# EAGLE design BeamerCtrl (EAGLE 6.4)
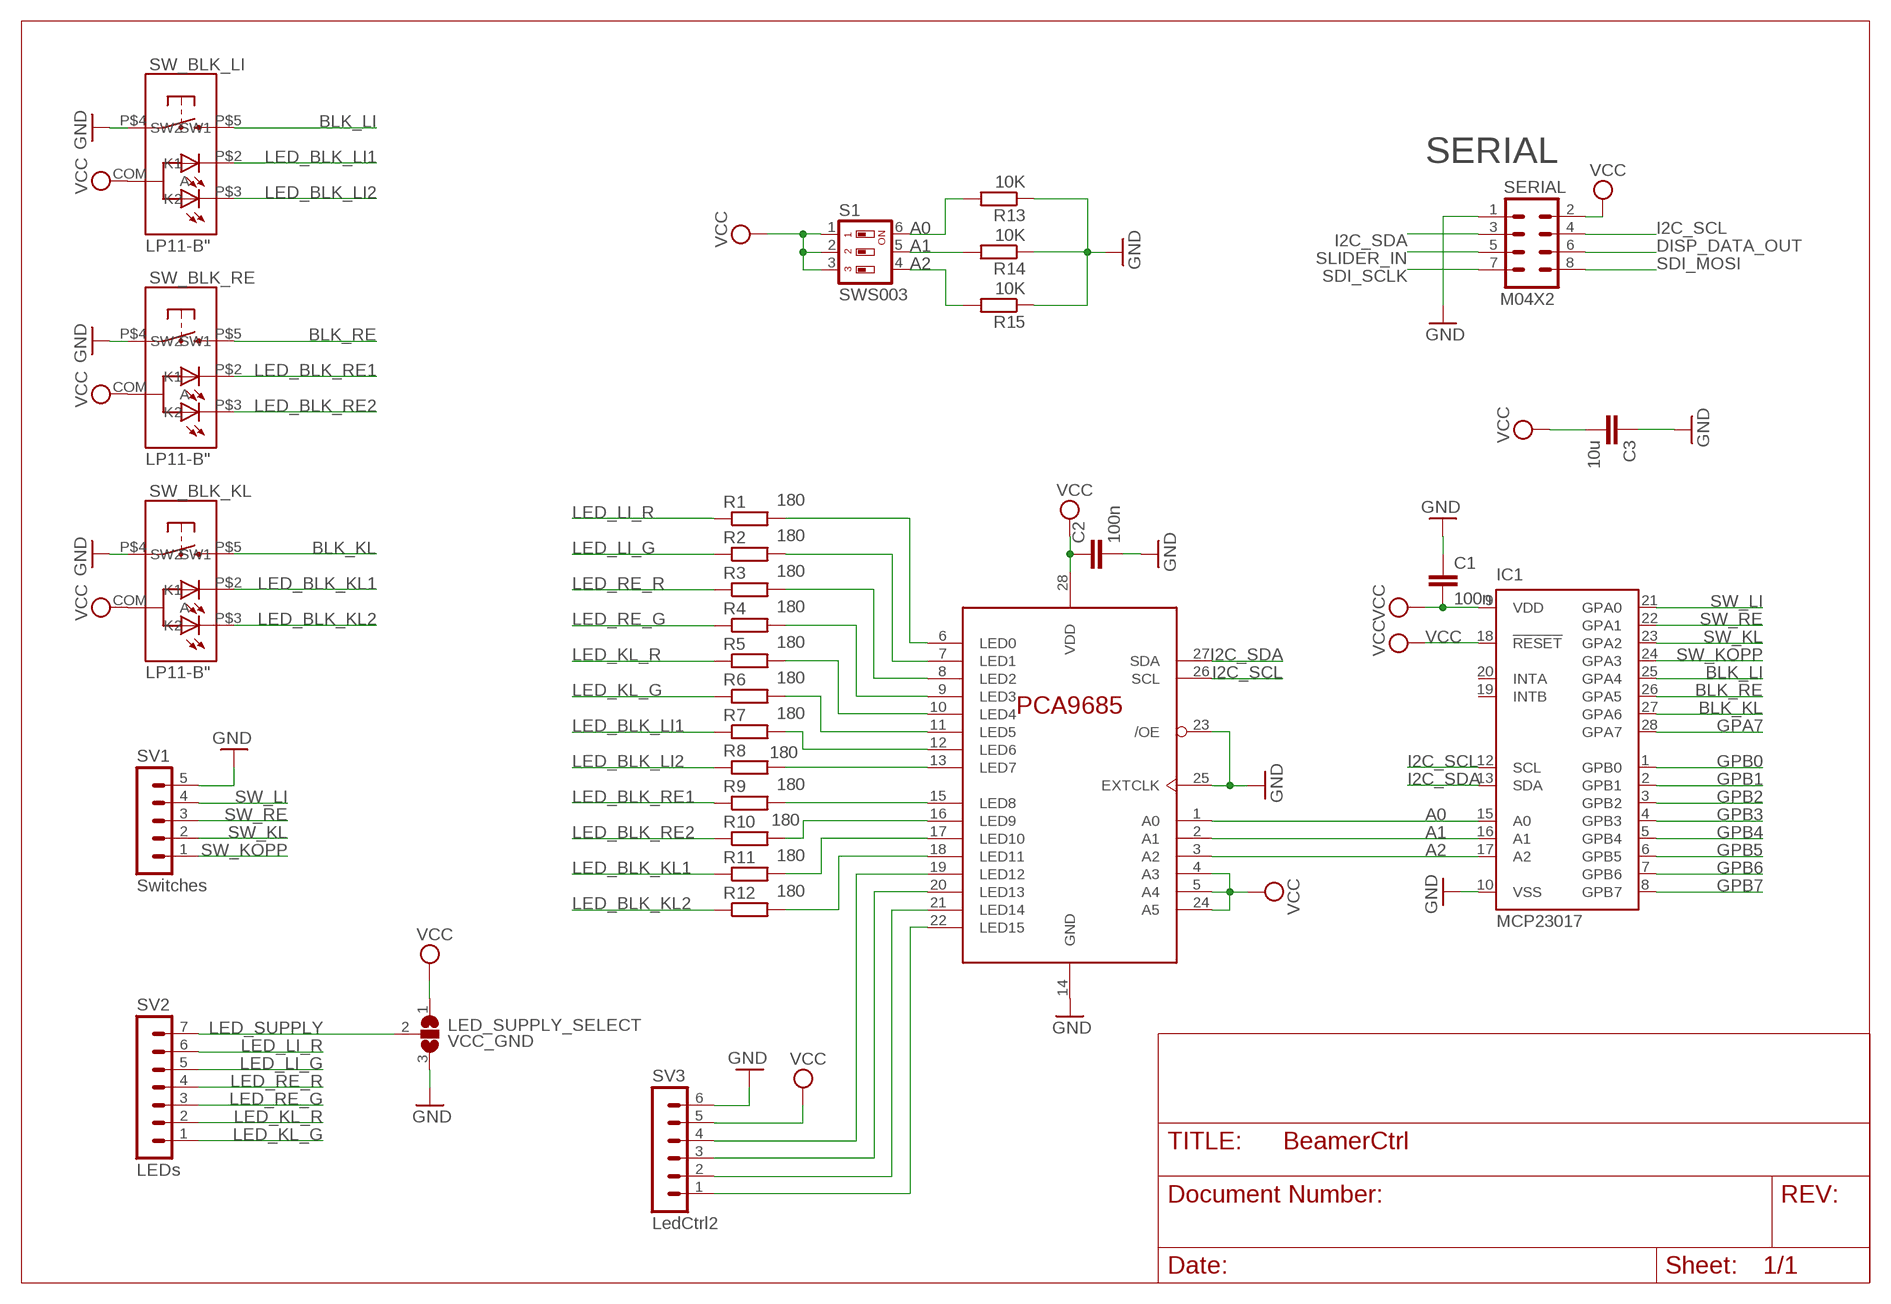
[diagram p0: schematic, sheet 1]

## Parts
C1  100n  C-EUC0603  [C0603]
C2  100n  C-EUC0603  [C0603]
C3  10u  C-EUC0805  [C0805]
IC1  MCP23017  MCP23017SS  [SSOP28]
IC2  PCA9685PW  [TSSOP28]
LED_SUPPLY_SELECT  VCC_GND  SJ2W  [SJ_2]
R1  180  R-EU_R0603  [R0603]
R2  180  R-EU_R0603  [R0603]
R3  180  R-EU_R0603  [R0603]
R4  180  R-EU_R0603  [R0603]
R5  180  R-EU_R0603  [R0603]
R6  180  R-EU_R0603  [R0603]
R7  180  R-EU_R0603  [R0603]
R8  180  R-EU_R0603  [R0603]
R9  180  R-EU_R0603  [R0603]
R10  180  R-EU_R0603  [R0603]
R11  180  R-EU_R0603  [R0603]
R12  180  R-EU_R0603  [R0603]
R13  10K  R-EU_R0603  [R0603]
R14  10K  R-EU_R0603  [R0603]
R15  10K  R-EU_R0603  [R0603]
S1  SWS003  [SMS-003]
SERIAL  M04X2  [2X4]
SV1  Switches  MA05-1  [MA05-1]
SV2  LEDs  MA07-1  [MA07-1]
SV3  LedCtrl2  MA06-1  [MA06-1]
SW_BLK_KL  LP11-B"  [LP11]
SW_BLK_LI  LP11-B"  [LP11]
SW_BLK_RE  LP11-B"  [LP11]

## Nets
A0: IC1.15(A0) IC2.1(A0) R13.2 S1.6
A1: IC1.16(A1) IC2.2(A1) R14.2 S1.5
A2: IC1.17(A2) IC2.3(A2) R15.2 S1.4
BLK_KL: IC1.27(GPA6) SW_BLK_KL.P$5(SW2)
BLK_LI: IC1.25(GPA4) SW_BLK_LI.P$5(SW2)
BLK_RE: IC1.26(GPA5) SW_BLK_RE.P$5(SW2)
DISP_DATA_OUT: SERIAL.6
GND: C1.1 C2.2 C3.1 IC1.10(VSS) IC2.14(GND) IC2.23(/OE) IC2.25(EXTCLK) LED_SUPPLY_SELECT.3 R13.1 R14.1 R15.1 SERIAL.1 SV1.5 SV3.6 SW_BLK_KL.P$4(SW1) SW_BLK_LI.P$4(SW1) SW_BLK_RE.P$4(SW1)
GPA7: IC1.28(GPA7)
GPB0: IC1.1(GPB0)
GPB1: IC1.2(GPB1)
GPB2: IC1.3(GPB2)
GPB3: IC1.4(GPB3)
GPB4: IC1.5(GPB4)
GPB5: IC1.6(GPB5)
GPB6: IC1.7(GPB6)
GPB7: IC1.8(GPB7)
I2C_SCL: IC1.12(SCL) IC2.26(SCL) SERIAL.4
I2C_SDA: IC1.13(SDA) IC2.27(SDA) SERIAL.3
LED_BLK_KL1: R11.1 SW_BLK_KL.P$2(K1)
LED_BLK_KL2: R12.1 SW_BLK_KL.P$3(K2)
LED_BLK_LI1: R7.1 SW_BLK_LI.P$2(K1)
LED_BLK_LI2: R8.1 SW_BLK_LI.P$3(K2)
LED_BLK_RE1: R9.1 SW_BLK_RE.P$2(K1)
LED_BLK_RE2: R10.1 SW_BLK_RE.P$3(K2)
LED_KL_G: R6.1 SV2.1
LED_KL_R: R5.1 SV2.2
LED_LI_G: R2.1 SV2.5
LED_LI_R: R1.1 SV2.6
LED_RE_G: R4.1 SV2.3
LED_RE_R: R3.1 SV2.4
LED_SUPPLY: LED_SUPPLY_SELECT.2 SV2.7
N$1: IC2.19(LED12) SV3.4
N$2: IC2.20(LED13) SV3.3
N$3: IC2.21(LED14) SV3.2
N$4: IC2.22(LED15) SV3.1
N$25: IC2.6(LED0) R1.2
N$26: IC2.7(LED1) R2.2
N$27: IC2.8(LED2) R3.2
N$28: IC2.9(LED3) R4.2
N$29: IC2.10(LED4) R5.2
N$30: IC2.11(LED5) R6.2
N$31: IC2.12(LED6) R7.2
N$32: IC2.13(LED7) R8.2
N$33: IC2.15(LED8) R9.2
N$34: IC2.16(LED9) R10.2
N$35: IC2.17(LED10) R11.2
N$36: IC2.18(LED11) R12.2
SDI_MOSI: SERIAL.8
SDI_SCLK: SERIAL.7
SLIDER_IN: SERIAL.5
SW_KL: IC1.23(GPA2) SV1.2
SW_KOPP: IC1.24(GPA3) SV1.1
SW_LI: IC1.21(GPA0) SV1.4
SW_RE: IC1.22(GPA1) SV1.3
VCC: C1.2 C2.1 C3.2 IC1.9(VDD) IC1.18(!RESET) IC2.4(A3) IC2.5(A4) IC2.24(A5) IC2.28(VDD) LED_SUPPLY_SELECT.1 S1.1 S1.2 S1.3 SERIAL.2 SV3.5 SW_BLK_KL.COM(A) SW_BLK_LI.COM(A) SW_BLK_RE.COM(A)
Unconnected: IC1.19(INTB) IC1.20(INTA)

## Notes on the sheet
- SERIAL

## Library data of the parts
C1-C3 = resistor:C-EU: CAPACITOR, European symbol
IC1 = microchip:MCP23017: http://ww1.microchip.com/downloads/en/DeviceDoc/21952a.pdf Source: http://ww1.microchip.com/downloads/en/DeviceDoc/21952a.pdf; MF: MICROCHIP; MPN: MCP23017-E/SS; OC_FARNELL: 1467674; OC_NEWARK: 31K2960
IC2 = i2c-led-controller:PCA9685
LED_SUPPLY_SELECT = jumper:SJ2W: SMD solder JUMPER
R1-R15 = resistor:R-EU_: RESISTOR, European symbol
S1 = smd-special:SWS003: SMD Dip Switch 3 pol.
SERIAL = SparkFun:M04X2
SV1 = con-lstb:MA05-1: PIN HEADER; OC_FARNELL: unknown; OC_NEWARK: unknown
SV2 = con-lstb:MA07-1: PIN HEADER; OC_FARNELL: unknown; OC_NEWARK: unknown
SV3 = con-lstb:MA06-1: PIN HEADER; OC_FARNELL: unknown; OC_NEWARK: unknown
SW_BLK_KL SW_BLK_LI SW_BLK_RE = SKAARHOJ:LP11-B

## Net classes
0 default: width 0.203 mm, drill 0.305 mm, clearance 0.203 mm
1 Power: width 0.305 mm, drill 0.61 mm, clearance 0.203 mm

## Board
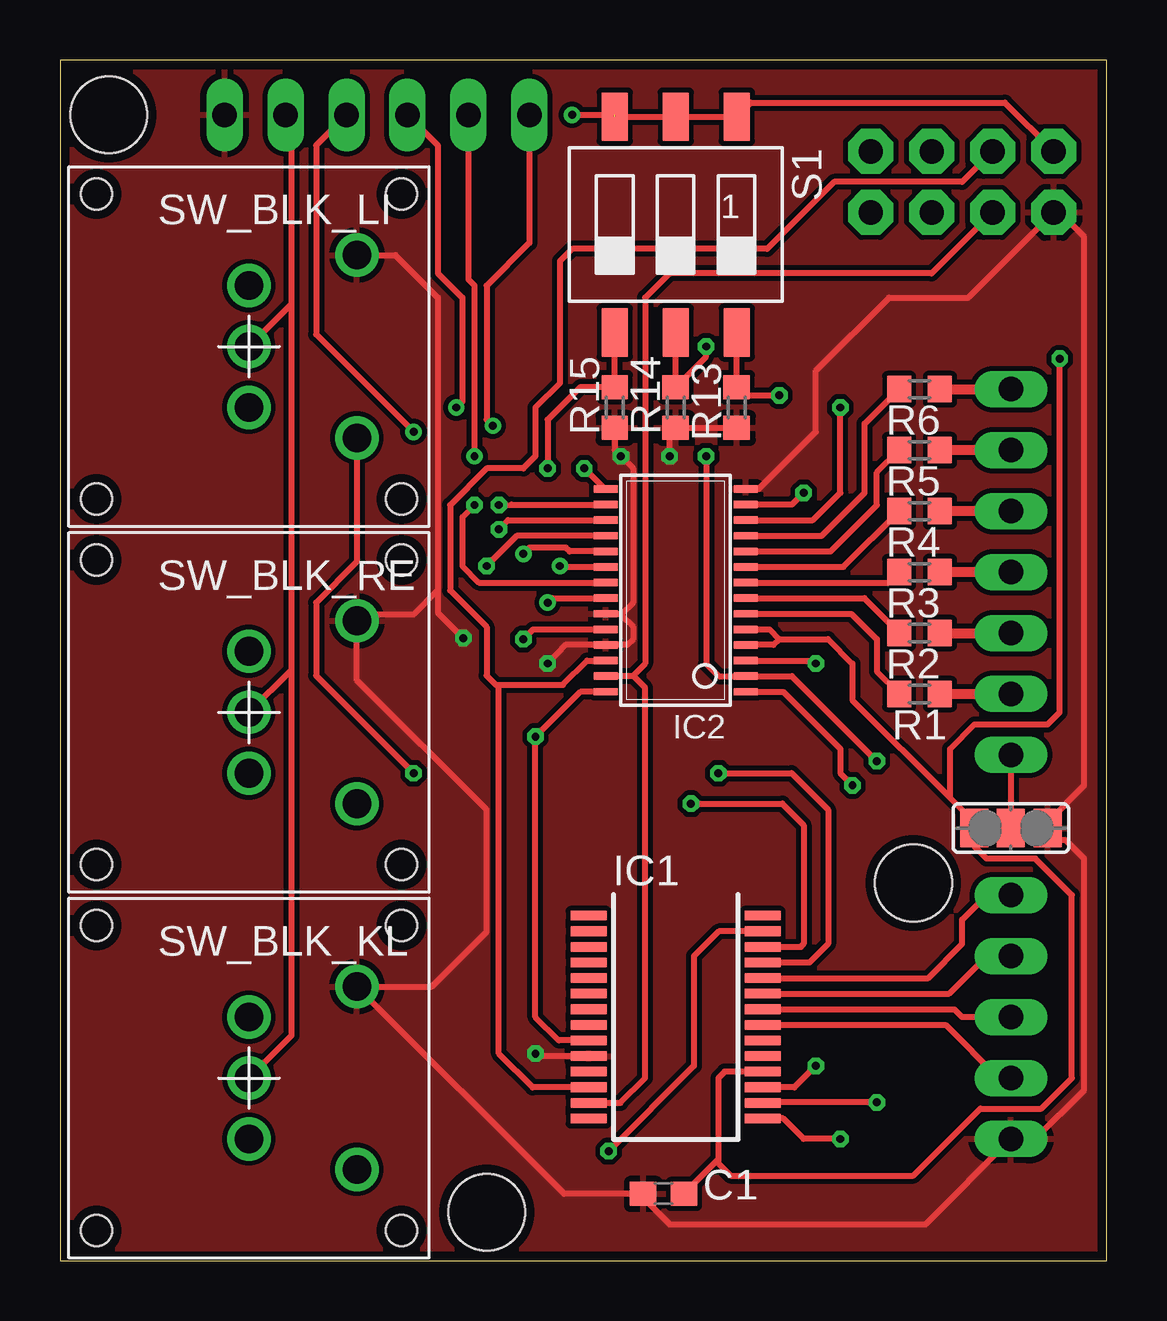
[diagram p1: board, top side]
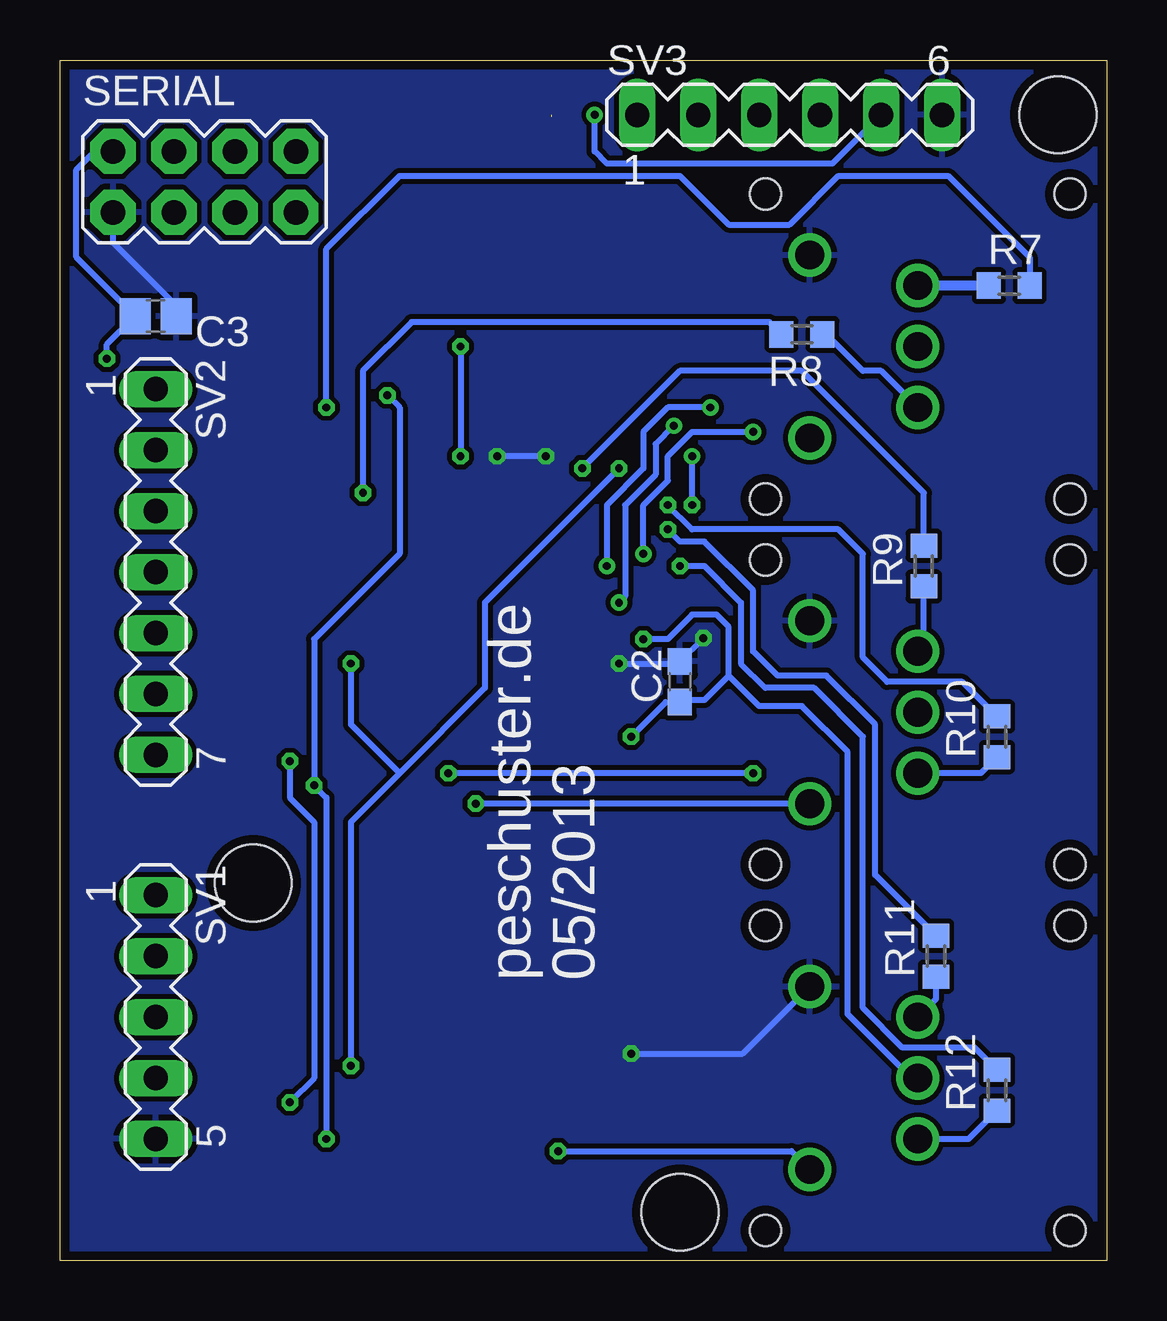
[diagram p2: board, bottom side, seen from below]

Size 43.61 x 50.03 mm. Coordinates in mm from the lower left corner, seen from the top.
Outline: 0,0 43.61,0 43.61,50.03 0,50.03 0,0
Copper layers (1*16): Top 0.0356mm / dielectric 1.5011mm / Bottom 0.0356mm
Design rules "OshPark_PCBOrder": minimum track width 6mil, minimum drill 13mil, track to track 6mil, track to pad 6mil, pad to pad 6mil, via to via 6mil, smd to smd 6mil, copper to edge 15mil, drill to drill 6mil, minimum pad ring 7mil, minimum via ring 7mil, stop-mask expansion 4mil, vias tented up to drill 0mil, thermal gap 10mil
Holes 3.2 mm at 17.78,2.03 35.56,15.75 2.03,47.75

### Footprints (pad centres in the part's own frame; a part is rotated, then mirrored left to right if it is on the bottom)
C0603 = smd 1.1 x 1: 1 -0.85,0; 2 0.85,0
C0805 = smd 1.3 x 1.5: 1 -0.85,0; 2 0.85,0
SSOP28 = smd 0.4 x 1.5: 1 -4.225,-3.625; 2 -3.575,-3.625; 3 -2.925,-3.625; 4 -2.275,-3.625; 5 -1.625,-3.625; 6 -0.975,-3.625; 7 -0.325,-3.625; 8 0.325,-3.625; 9 0.975,-3.625; 10 1.625,-3.625; 11 2.275,-3.625; 12 2.925,-3.625; 13 3.575,-3.625; 14 4.225,-3.625; 15 4.225,3.625; 16 3.575,3.625; 17 2.925,3.625; 18 2.275,3.625; 19 1.625,3.625; 20 0.975,3.625; 21 0.325,3.625; 22 -0.325,3.625; 23 -0.975,3.625; 24 -1.625,3.625; 25 -2.275,3.625; 26 -2.925,3.625; 27 -3.575,3.625; 28 -4.225,3.625
TSSOP28 = smd 0.305 x 0.991: 1 -4.225,-2.918; 2 -3.575,-2.918; 3 -2.925,-2.918; 4 -2.275,-2.918; 5 -1.625,-2.918; 6 -0.975,-2.918; 7 -0.325,-2.918; 8 0.325,-2.918; 9 0.975,-2.918; 10 1.625,-2.918; 11 2.275,-2.918; 12 2.925,-2.918; 13 3.575,-2.918; 14 4.225,-2.918; 15 4.225,2.918; 16 3.575,2.918; 17 2.925,2.918; 18 2.275,2.918; 19 1.625,2.918; 20 0.975,2.918; 21 0.325,2.918; 22 -0.325,2.918; 23 -0.975,2.918; 24 -1.625,2.918; 25 -2.275,2.918; 26 -2.925,2.918; 27 -3.575,2.918; 28 -4.225,2.918
SJ_2 = smd 1.168 x 1.6: 1 -1.524,0; 2 0,0; 3 1.524,0
R0603 = smd 1 x 1.1: 1 -0.85,0; 2 0.85,0
SMS-003 = smd 1.092 x 2.007: 1 -2.54,-4.496; 2 0,-4.496; 3 2.54,-4.496; 4 2.54,4.496; 5 0,4.496; 6 -2.54,4.496
2X4 = drill 1.016 pad 1.88 octagon: 1 -3.81,-1.27; 2 -3.81,1.27; 3 -1.27,-1.27; 4 -1.27,1.27; 5 1.27,-1.27; 6 1.27,1.27; 7 3.81,-1.27; 8 3.81,1.27
MA05-1 = drill 1.016 long: 1 -5.08,0; 2 -2.54,0; 3 0,0; 4 2.54,0; 5 5.08,0
MA07-1 = drill 1.016 long: 1 -7.62,0; 2 -5.08,0; 3 -2.54,0; 4 0,0; 5 2.54,0; 6 5.08,0; 7 7.62,0
MA06-1 = drill 1.016 long: 1 -6.35,0; 2 -3.81,0; 3 -1.27,0; 4 1.27,0; 5 3.81,0; 6 6.35,0
LP11 = drill 1.2: COM 0,0; P$2 0,2.54; P$3 0,-2.54; P$4 4.5,3.81; P$5 4.5,-3.81 | hole 1.3: -6.35,6.35; 6.35,6.35; 6.35,-6.35; -6.35,-6.35

### Placement (x,y rotation side)
C1  25.15,2.79 0 top
C2  17.78,24.13 90 bottom
C3  39.62,39.37 180 bottom
IC1  25.65,10.16 270 top
IC2  25.65,27.94 90 top
LED_SUPPLY_SELECT  39.62,18.03 0 top
R1  35.81,23.62 180 top
R2  35.81,26.16 180 top
R3  35.81,28.7 180 top
R4  35.81,31.24 180 top
R5  35.81,33.78 180 top
R6  35.81,36.32 180 top
R7  4.06,40.64 0 bottom
R8  12.7,38.61 180 bottom
R9  7.62,28.96 90 bottom
R10  4.57,21.84 90 bottom
R11  7.11,12.7 90 bottom
R12  4.57,7.11 90 bottom
R13  28.19,35.56 90 top
R14  25.65,35.56 90 top
R15  23.11,35.56 90 top
S1  25.65,43.18 180 top
SERIAL  37.59,44.96 0 bottom
SV1  39.62,10.16 270 bottom
SV2  39.62,28.7 270 bottom
SV3  13.21,47.75 0 bottom
SW_BLK_KL  7.87,7.62 0 top
SW_BLK_LI  7.87,38.1 0 top
SW_BLK_RE  7.87,22.86 0 top

### Tracks (layer width: path | path; a pad name or v marks a point on that pad's centre or on a via)
A0  (via drill 0.33)
  Top 0.254: S1.6 R13.2 28.54,36.07 v29.97,36.07 | IC2.1 30.13,23.71 32.51,21.34 32.51,20.32 v33.02,19.81 | v32.51,5.08 30.99,5.08 30.13,5.93 IC1.15
  Bottom 0.254: v32.51,5.08 32.51,19.3 v33.02,19.81 33.02,25.91 29.46,29.46 29.46,35.56 v29.97,36.07
A1  (via drill 0.33)
  Top 0.254: S1.5 R14.2 26.92,37.68 v26.92,38.1 | v34.04,20.83 30.5,24.36 IC2.2 27.45,24.36 26.92,24.89 v26.92,33.53 | v34.04,6.6 29.3,6.6 IC1.16
  Bottom 0.254: v34.04,20.83 34.04,19.3 33.02,18.29 33.02,7.62 v34.04,6.6 | v26.92,38.1 v26.92,33.53
A2  (via drill 0.33)
  Top 0.254: S1.4 R15.2 21.68,36.41 20.32,35.05 v20.32,33.02 | v31.5,8.13 30.6,7.24 IC1.17 | IC2.3 31.37,25.02 v31.5,24.89
  Bottom 0.254: v20.32,33.02 25.91,27.43 25.91,23.88 29.46,20.32 | 29.46,20.32 31.5,18.29 v31.5,8.13 | v31.5,24.89 31.5,22.35 29.46,20.32
BLK_KL  (via drill 0.33)
  Top 0.254: IC1.27 27.45,13.73 26.42,12.7 26.42,8.13 v22.86,4.57
  Bottom 0.254: v22.86,4.57 13.14,4.57 SW_BLK_KL.P$5
BLK_LI  (via drill 0.33)
  Top 0.254: IC1.25 31.23,12.44 32,13.21 32,18.8 30.48,20.32 v27.43,20.32 | SW_BLK_LI.P$5 12.37,29.14 10.67,27.43 10.67,24.38 v14.73,20.32
  Bottom 0.254: v14.73,20.32 v27.43,20.32
BLK_RE  (via drill 0.33)
  Top 0.254: v26.29,19.05 30.1,19.05 30.99,18.16 30.99,13.21 30.86,13.09 IC1.26
  Bottom 0.254: SW_BLK_RE.P$5 v26.29,19.05
GND  (via drill 0.33)
  Top 0.254: R15.1 23.11,33.78 v23.37,33.53 23.88,33.02 23.88,27.43 23.37,26.92 | v25.4,33.53 25.4,34.46 R14.1 R13.1 | IC1.10 19.91,8.54 v19.81,8.64 | LED_SUPPLY_SELECT.3 41.66,17.53 41.91,17.53 42.67,16.76 42.67,7.11 40.64,5.08 SV1.5 36.07,1.52 25.4,1.52 24.3,2.63 C1.1 21.01,2.79 SW_BLK_KL.P$4 15.49,11.43 17.78,13.72 17.78,18.8 12.37,24.2 SW_BLK_RE.P$4 12.63,26.92 14.73,26.92 15.75,27.94 | SW_BLK_LI.P$4 13.97,41.91 15.75,40.13 15.75,27.94 | 15.75,27.94 15.75,27.01 v16.81,25.95 | 23.37,26.92 23.33,26.96 IC2.23 | 23.37,26.92 23.88,26.42 23.88,25.91 23.63,25.66 IC2.25 21.07,25.66 v20.32,24.89 | 41.15,17.78 41.15,18.29 42.67,19.81 42.67,42.67 41.66,43.69 SERIAL.1 37.85,40.13 34.54,40.13 31.5,37.08 31.5,34.54 29.12,32.16 IC2.14
  Bottom 0.254: v23.37,33.53 v25.4,33.53 | v19.81,8.64 15.17,8.64 SW_BLK_KL.P$4 | v16.81,25.95 C2.2 18.2,24.89 v20.32,24.89 | C3.1 38.77,39.79 41.4,42.42 SERIAL.1
  pour Bottom: -0.51,50.8 44.2,49.78 44.2,-0.51 -0.51,-0.51
  pour Top: -0.51,50.8 44.2,50.8 44.2,-0.51 -0.51,-0.51
I2C_SCL
  Top 0.254: SERIAL.4 37.59,44.96 32.26,44.96 29.46,42.16 21.34,42.16 20.83,41.66 20.83,36.58 19.81,35.56 19.81,33.53 19.3,33.02 17.78,33.02 16.26,31.5 16.26,27.94 17.78,26.42 17.78,24.38 18.16,24 18.29,24 | 18.29,24 20.95,24 21.97,25.02 IC2.26 | IC1.12 19.69,7.24 18.29,8.64 18.29,24
I2C_SDA
  Top 0.254: SERIAL.3 36.32,41.15 25.4,41.15 24.38,40.13 24.38,24.89 23.88,24.38 | 23.88,24.38 23.86,24.36 IC2.27 | IC1.13 23.35,6.58 24.38,7.62 24.38,23.88 23.88,24.38
LED_BLK_KL1
  Bottom 0.254: SW_BLK_KL.P$2 7.11,10.92 R11.1
LED_BLK_KL2
  Bottom 0.254: SW_BLK_KL.P$3 5.75,5.08 R12.1
LED_BLK_LI1
  Bottom 0.406: R7.1 SW_BLK_LI.P$2
LED_BLK_LI2
  Bottom 0.254: SW_BLK_LI.P$3 9.4,37.08 10.16,37.08 11.68,38.61 R8.1
LED_BLK_RE1
  Bottom 0.254: SW_BLK_RE.P$2 7.62,25.65 R9.1
LED_BLK_RE2
  Bottom 0.254: R10.1 5.25,20.32 SW_BLK_RE.P$3
LED_KL_G
  Top 0.406: R6.1 SV2.1
LED_KL_R
  Top 0.406: SV2.2 R5.1
LED_LI_G
  Top 0.406: R2.1 SV2.5
LED_LI_R
  Top 0.406: R1.1 SV2.6
LED_RE_G
  Top 0.406: SV2.3 R4.1
LED_RE_R
  Top 0.406: SV2.4 R3.1
LED_SUPPLY
  Top 0.254: SV2.7 LED_SUPPLY_SELECT.2
N$1  (via drill 0.33)
  Top 0.254: SV3.4 10.67,46.48 10.67,38.61 v14.73,34.54 | IC2.19 21.23,29.57 21.08,29.72 19.56,29.72 v19.3,29.46
  Bottom 0.254: v19.3,29.46 19.3,31.5 18.29,32.51 18.29,33.53 17.27,34.54 v14.73,34.54
N$2  (via drill 0.33)
  Top 0.254: SV3.3 15.75,46.48 15.75,41.15 16.76,40.13 16.76,35.81 v16.51,35.56 | v20.83,28.96 20.87,28.91 IC2.20
  Bottom 0.254: v16.51,35.56 18.29,35.56 19.3,34.54 19.3,33.02 20.83,31.5 v20.83,28.96
N$3  (via drill 0.33)
  Top 0.254: SV3.2 17.02,40.89 17.27,40.64 v17.27,33.53 | v17.27,31.5 16.76,30.99 16.76,28.96 17.45,28.27 IC2.21
  Bottom 0.254: v17.27,31.5 v17.27,33.53
N$4  (via drill 0.33)
  Top 0.254: SV3.1 19.56,42.42 17.78,40.64 17.78,35.05 v18.03,34.8 | IC2.22 20.5,27.61 v20.32,27.43
  Bottom 0.254: v18.03,34.8 18.8,34.04 18.8,32.77 20.07,31.5 20.07,27.69 v20.32,27.43
N$25
  Top 0.254: IC2.6 32.98,26.96 34.04,25.91 34.04,24.55 R1.2
N$26
  Top 0.254: IC2.7 33.51,27.61 R2.2
N$27
  Top 0.254: IC2.8 34.53,28.27 R3.2
N$28
  Top 0.254: IC2.9 32.64,28.91 R4.2
N$29
  Top 0.254: IC2.10 32.1,29.57 34.04,31.5 34.04,32.85 R5.2
N$30
  Top 0.254: IC2.11 31.74,30.21 33.53,32 33.53,34.89 R6.2
N$31  (via drill 0.33)
  Top 0.254: IC2.12 31.37,30.86 32.51,32 v32.51,35.56
  Bottom 0.254: v32.51,35.56 32.51,42.16 29.46,45.21 17.78,45.21 15.75,43.18 13.21,43.18 11.18,45.21 6.6,45.21 3.21,41.82 R7.2
N$32  (via drill 0.33)
  Top 0.254: v30.99,32 30.5,31.52 IC2.13
  Bottom 0.254: R8.2 14.06,39.12 28.96,39.12 30.99,37.08 v30.99,32
N$33  (via drill 0.33)
  Top 0.254: v21.84,33.02 22.7,32.16 IC2.15
  Bottom 0.254: v21.84,33.02 17.78,37.08 12.7,37.08 7.62,32 R9.2
N$34  (via drill 0.33)
  Top 0.254: v18.29,31.5 18.82,31.52 IC2.16
  Bottom 0.254: v18.29,31.5 17.27,30.48 11.18,30.48 10.16,29.46 10.16,25.15 9.14,24.13 6.01,24.13 R10.2
N$35  (via drill 0.33)
  Top 0.254: v18.29,30.48 18.67,30.86 IC2.17
  Bottom 0.254: v18.29,30.48 17.78,29.97 16.76,29.97 14.73,27.94 14.73,25.4 13.72,24.38 11.68,24.38 9.65,22.35 9.65,16.09 R11.2
N$36  (via drill 0.33)
  Top 0.254: IC2.18 19.04,30.21 v17.78,28.96
  Bottom 0.254: v17.78,28.96 16.76,28.96 15.24,27.43 15.24,24.89 14.22,23.88 12.19,23.88 10.16,21.84 10.16,10.54 8.51,8.89 5.5,8.89 R12.2
SW_KL
  Top 0.254: IC1.23 37.04,11.13 38.61,12.7 SV1.2
SW_KOPP
  Top 0.254: IC1.24 36.17,11.79 37.59,13.21 37.59,14.22 38.61,15.24 SV1.1
SW_LI
  Top 0.254: IC1.21 36.9,9.84 39.12,7.62 SV1.4
SW_RE
  Top 0.254: SV1.3 37.59,10.16 37.27,10.48 IC1.22
VCC  (via drill 0.33)  (1 unrouted)
  Top 0.254: 9.65,39.88 SW_BLK_LI.COM | SW_BLK_RE.COM 9.65,24.64 | 9.65,24.64 9.65,39.88 | SW_BLK_KL.COM 9.65,9.4 9.65,24.64 | IC1.18 27.7,7.88 27.43,7.62 27.43,4.23 | 27.43,4.23 C1.2 | IC1.9 20.79,9.19 19.81,10.16 v19.81,21.84 21.68,23.71 IC2.28 | 27.43,4.23 27.43,4.06 27.94,3.56 35.56,3.56 38.35,6.35 40.89,6.35 42.16,7.62 42.16,15.24 40.64,16.76 38.61,16.76 38.1,17.27 LED_SUPPLY_SELECT.1 38.1,18.29 37.08,19.3 | SERIAL.2 39.37,48.26 28.78,48.26 S1.1 S1.2 S1.3 23.04,47.75 v21.34,47.75 | 29.97,25.91 29.73,25.66 IC2.4 | IC2.5 29.57,26.32 29.97,25.91 | 29.97,25.91 32,25.91 33.02,24.89 33.02,23.37 37.08,19.3 | 37.08,19.3 37.08,21.34 38.1,22.35 41.15,22.35 41.66,22.86 v41.66,37.59 | 9.65,39.88 9.65,47.5 SV3.5 | v19.3,25.91 19.71,26.32 IC2.24 | 23.11,47.75 23.37,47.75
  Bottom 0.254: 7.62,7.62 SW_BLK_KL.COM 8.13,7.62 10.79,10.29 10.79,21.21 12.7,23.11 14.48,23.11 15.75,24.38 | SERIAL.2 42.16,46.23 42.93,45.47 42.93,41.82 C3.2 41.66,38.19 v41.66,37.59 | 15.75,24.38 16.76,23.37 17.69,23.37 C2.1 18.38,23.28 v19.81,21.84 | 15.75,24.38 15.75,26.42 16.26,26.92 17.27,26.92 18.29,25.91 v19.3,25.91 | SV3.5 11.43,45.72 20.83,45.72 21.34,46.23 v21.34,47.75

### Text on the board
bNames: peschuster.de / 05/2013